# EAGLE design com_board (EAGLE 9.6.2)
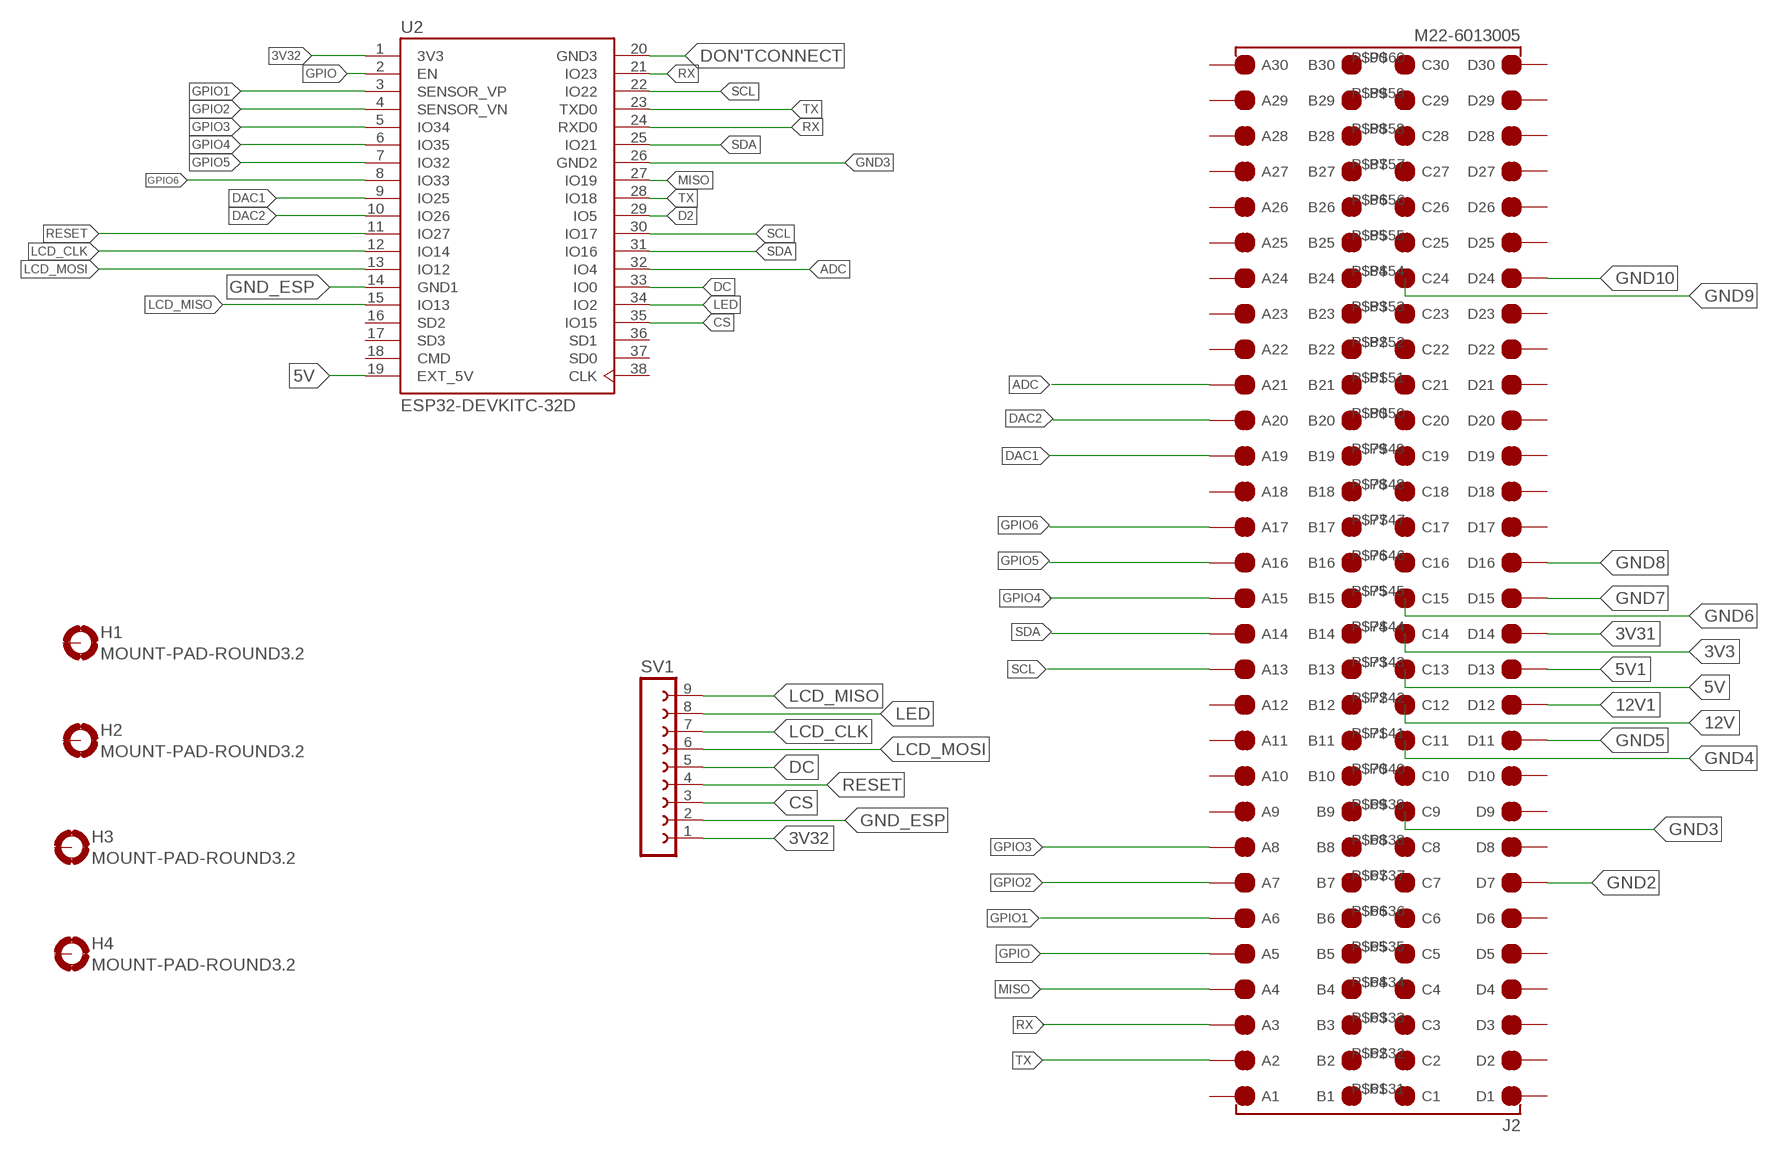
[diagram p0: schematic, sheet 1]

## Parts
H1  MOUNT-PAD-ROUND3.2  [3,2-PAD]
H2  MOUNT-PAD-ROUND3.2  [3,2-PAD]
H3  MOUNT-PAD-ROUND3.2  [3,2-PAD]
H4  MOUNT-PAD-ROUND3.2  [3,2-PAD]
J2  M22-6013005  [RHDR120W55P200_4X30_6020X820X9]
SV1  FE09-1  [FE09]
U2  ESP32-DEVKITC-32D  [MODULE_ESP32-DEVKITC-32D]

## Nets
3V3: J2.P$44(C14)
3V31: J2.P$14(D14)
3V32: SV1.1 U2.1(3V3)
5V: J2.P$43(C13) U2.19(EXT_5V)
5V1: J2.P$13(D13)
12V: J2.P$42(C12)
12V1: J2.P$12(D12)
ADC: J2.P$111(A21) U2.32(IO4)
CS: SV1.3 U2.35(IO15)
D2: U2.29(IO5)
DAC1: J2.P$109(A19) U2.9(IO25)
DAC2: J2.P$110(A20) U2.10(IO26)
DC: SV1.5 U2.33(IO0)
DON'TCONNECT: U2.20(GND3)
GND2: J2.P$7(D7)
GND3: J2.P$39(C9) U2.26(GND2)
GND4: J2.P$41(C11)
GND5: J2.P$11(D11)
GND6: J2.P$45(C15)
GND7: J2.P$15(D15)
GND8: J2.P$16(D16)
GND9: J2.P$54(C24)
GND10: J2.P$24(D24)
GND_ESP: SV1.2 U2.14(GND1)
GPIO: J2.P$95(A5) U2.2(EN)
GPIO1: J2.P$96(A6) U2.3(SENSOR_VP)
GPIO2: J2.P$97(A7) U2.4(SENSOR_VN)
GPIO3: J2.P$98(A8) U2.5(IO34)
GPIO4: J2.P$105(A15) U2.6(IO35)
GPIO5: J2.P$106(A16) U2.7(IO32)
GPIO6: J2.P$107(A17) U2.8(IO33)
LCD_CLK: SV1.7 U2.12(IO14)
LCD_MISO: SV1.9 U2.15(IO13)
LCD_MOSI: SV1.6 U2.13(IO12)
LED: SV1.8 U2.34(IO2)
MISO: J2.P$94(A4) U2.27(IO19)
RESET: SV1.4 U2.11(IO27)
RX: J2.P$93(A3) U2.21(IO23) U2.24(RXD0)
SCL: J2.P$103(A13) U2.22(IO22) U2.30(IO17)
SDA: J2.P$104(A14) U2.25(IO21) U2.31(IO16)
TX: J2.P$92(A2) U2.23(TXD0) U2.28(IO18)
Unconnected: H1.B3,2(MOUNT) H2.B3,2(MOUNT) H3.B3,2(MOUNT) H4.B3,2(MOUNT) J2.P$1(D1) J2.P$2(D2) J2.P$3(D3) J2.P$4(D4) J2.P$5(D5) J2.P$6(D6) J2.P$8(D8) J2.P$9(D9) J2.P$10(D10) J2.P$17(D17) J2.P$18(D18) J2.P$19(D19) J2.P$20(D20) J2.P$21(D21) J2.P$22(D22) J2.P$23(D23) J2.P$25(D25) J2.P$26(D26) J2.P$27(D27) J2.P$28(D28) J2.P$29(D29) J2.P$30(D30) J2.P$31(C1) J2.P$32(C2) J2.P$33(C3) J2.P$34(C4) J2.P$35(C5) J2.P$36(C6) J2.P$37(C7) J2.P$38(C8) J2.P$40(C10) J2.P$46(C16) J2.P$47(C17) J2.P$48(C18) J2.P$49(C19) J2.P$50(C20) J2.P$51(C21) J2.P$52(C22) J2.P$53(C23) J2.P$55(C25) J2.P$56(C26) J2.P$57(C27) J2.P$58(C28) J2.P$59(C29) J2.P$60(C30) J2.P$61(B1) J2.P$62(B2) J2.P$63(B3) J2.P$64(B4) J2.P$65(B5) J2.P$66(B6) J2.P$67(B7) J2.P$68(B8) J2.P$69(B9) J2.P$70(B10) J2.P$71(B11) J2.P$72(B12) J2.P$73(B13) J2.P$74(B14) J2.P$75(B15) J2.P$76(B16) J2.P$77(B17) J2.P$78(B18) J2.P$79(B19) J2.P$80(B20) J2.P$81(B21) J2.P$82(B22) J2.P$83(B23) J2.P$84(B24) J2.P$85(B25) J2.P$86(B26) J2.P$87(B27) J2.P$88(B28) J2.P$89(B29) J2.P$90(B30) J2.P$91(A1) J2.P$99(A9) J2.P$100(A10) J2.P$101(A11) J2.P$102(A12) J2.P$108(A18) J2.P$112(A22) J2.P$113(A23) J2.P$114(A24) J2.P$115(A25) J2.P$116(A26) J2.P$117(A27) J2.P$118(A28) J2.P$119(A29) J2.P$120(A30) U2.16(SD2) U2.17(SD3) U2.18(CMD) U2.36(SD1) U2.37(SD0) U2.38(CLK)

## Library data of the parts
H1-H4 = holes:MOUNT-PAD-ROUND: MOUNTING PAD, round
J2 = M22-6013005:M22-6013005: HARWIN - M22-6013005 - PCB Receptacle, Board-to-Board, 2 mm, 4 Rows, 120 Contacts, Through Hole Mount, M22 Series Source: Datasheet <https://ms.componentsearchengine.com/Datasheets/2/M22-6013005.pdf>; DESCRIPTION: HARWIN - M22-6013005 - PCB Receptacle, Board-to-Board, 2 mm, 4 Rows, 120 Contacts, Through Hole Mount, M22 Series; HEIGHT: 9.65mm; MANUFACTURER_NAME: Harwin; MANUFACTURER_PART_NUMBER: M22-6013005
SV1 = con-lsta:FE09-1: FEMALE HEADER; OC_FARNELL: unknown; OC_NEWARK: unknown
U2 = ESP32-DEVKITC-32D:ESP32-DEVKITC-32D: Eval Board For Esp-Wroom-32 Check prices <https://pricing.snapeda.com/parts/ESP32-DEVKITC-32D/Espressif%20Systems/view-part?ref=eda>; AVAILABILITY: Warning; DESCRIPTION: - Transceiver; 802.11 b/g/n (Wi-Fi, WiFi, WLAN), Bluetooth® Smart Ready 4.x Dual Mode For Use With ESP-WROOM-32; MF: Espressif Systems; MP: ESP32-DEVKITC-32D; PACKAGE: None; PRICE: None; PURCHASE-URL: https://pricing.snapeda.com/search/part/ESP32-DEVKITC-32D/?ref=eda

## Board
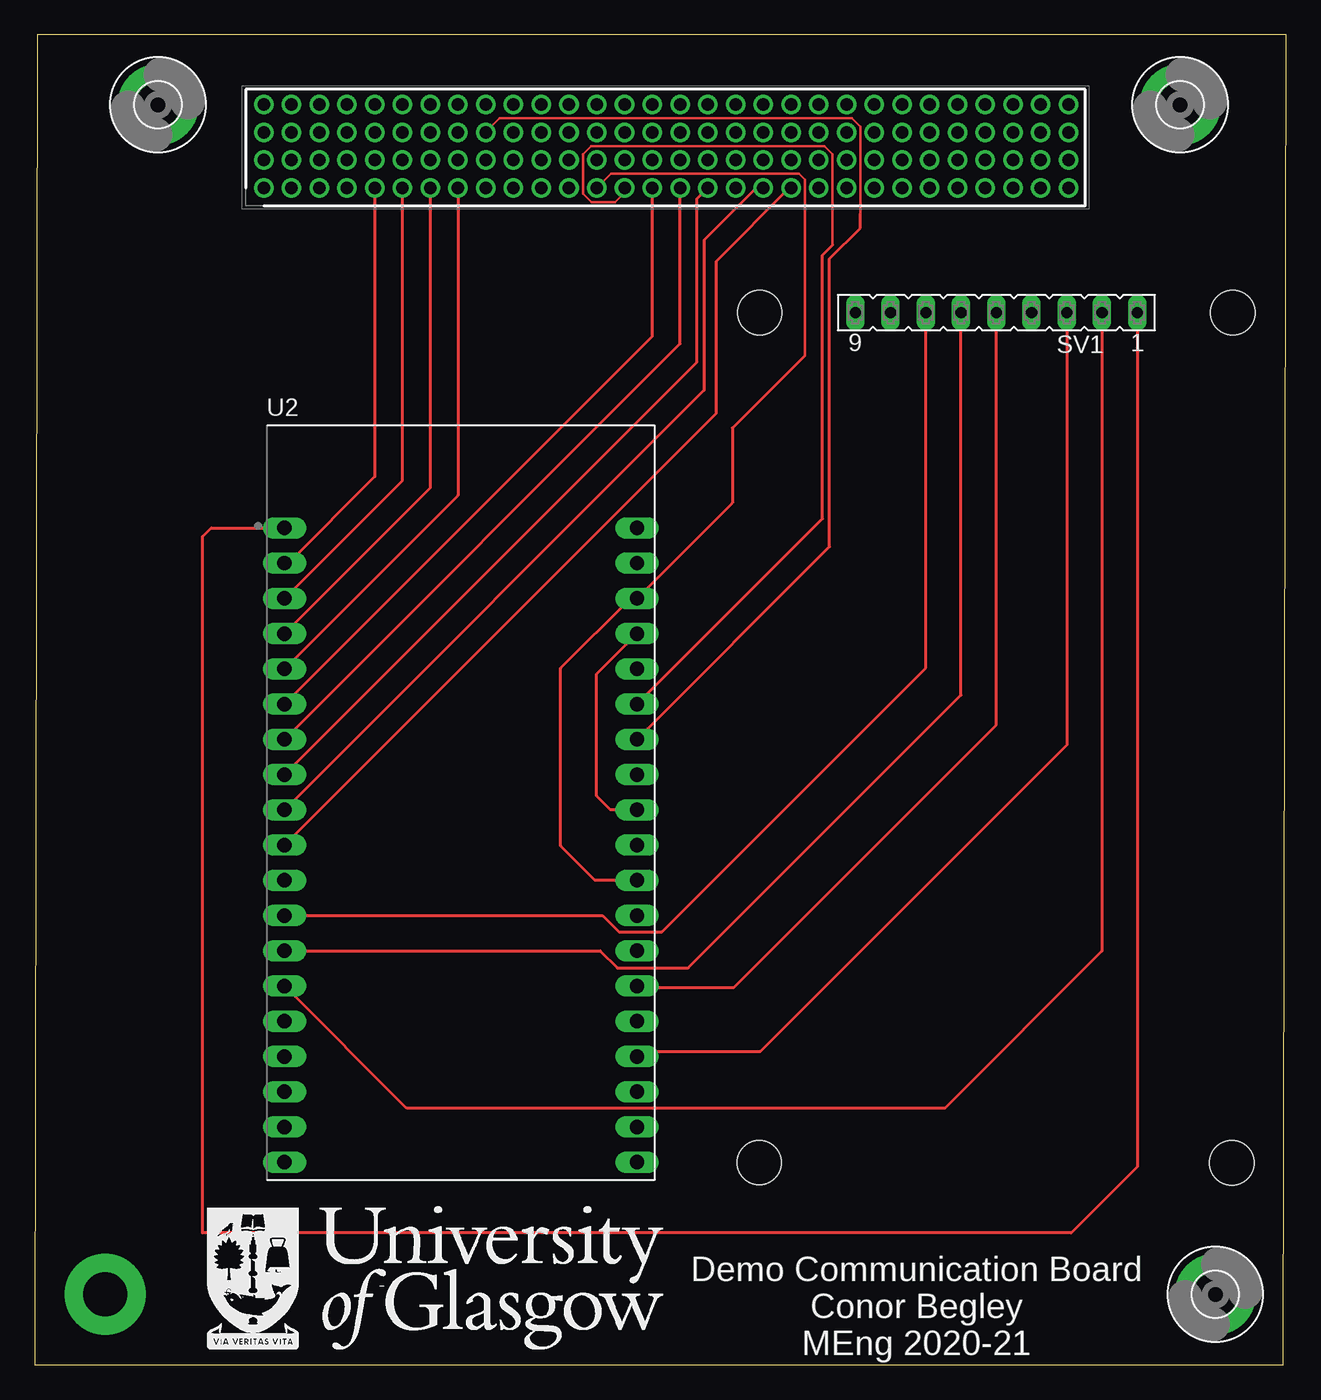
[diagram p1: board, top side]
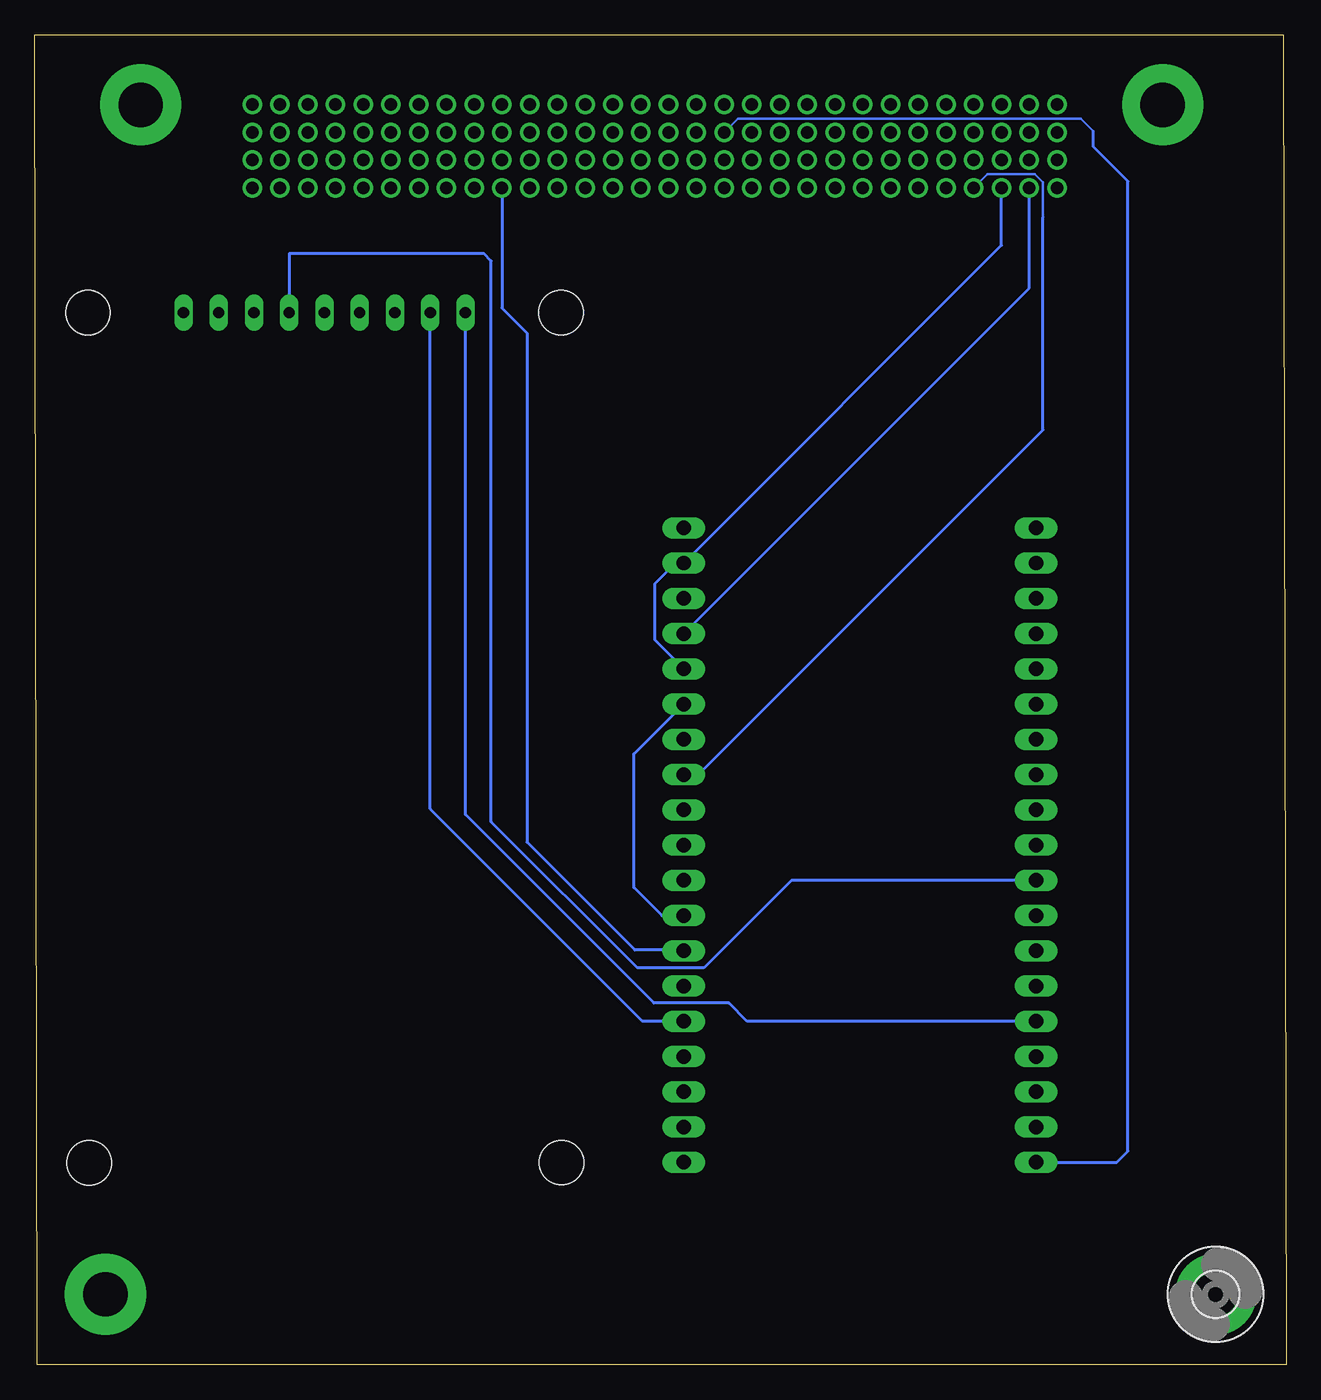
[diagram p2: board, bottom side, seen from below]

Size 90.19 x 95.86 mm. Coordinates in mm from the lower left corner, seen from the top.
Outline: 0,0 90,0 90.19,95.86 0.19,95.86 0,0
Copper layers (1*16): Top 0.035mm / dielectric 1.5mm / Bottom 0.035mm
Design rules "jlcpcb *": minimum track width 6mil, minimum drill 0.35mm, track to track 0.2mm, track to pad 0.2mm, pad to pad 0.54mm, via to via 10mil, smd to smd 6mil, copper to edge 40mil, drill to drill 6mil, minimum pad ring 10mil, minimum via ring 8mil, stop-mask expansion 4mil, vias tented up to drill 0mil, thermal gap 10mil
Holes 3.2 mm at 86.35,75.83 52.25,75.82 86.27,14.55 52.21,14.58

### Footprints (pad centres in the part's own frame; a part is rotated, then mirrored left to right if it is on the bottom)
3,2-PAD = drill 3.2 pad 5.842: B3,2 0,0
RHDR120W55P200_4X30_6020X820X9 = drill 0.9 pad 1.3: P$1 0,6; P$2 2,6; P$3 4,6; P$4 6,6; P$5 8,6; P$6 10,6; P$7 12,6; P$8 14,6; P$9 16,6; P$10 18,6; P$11 20,6; P$12 22,6; P$13 24,6; P$14 26,6; P$15 28,6; P$16 30,6; P$17 32,6; P$18 34,6; P$19 36,6; P$20 38,6; P$21 40,6; P$22 42,6; P$23 44,6; P$24 46,6; P$25 48,6; P$26 50,6; P$27 52,6; P$28 54,6; P$29 56,6; P$30 58,6; P$31 0,4; P$32 2,4; P$33 4,4; P$34 6,4; P$35 8,4; P$36 10,4; P$37 12,4; P$38 14,4; P$39 16,4; P$40 18,4; P$41 20,4; P$42 22,4; P$43 24,4; P$44 26,4; P$45 28,4; P$46 30,4; P$47 32,4; P$48 34,4; P$49 36,4; P$50 38,4; P$51 40,4; P$52 42,4; P$53 44,4; P$54 46,4; P$55 48,4; P$56 50,4; P$57 52,4; P$58 54,4; P$59 56,4; P$60 58,4; P$61 0,2; P$62 2,2; P$63 4,2; P$64 6,2; P$65 8,2; P$66 10,2; P$67 12,2; P$68 14,2; P$69 16,2; P$70 18,2; P$71 20,2; P$72 22,2; P$73 24,2; P$74 26,2; P$75 28,2; P$76 30,2; P$77 32,2; P$78 34,2; P$79 36,2; P$80 38,2; P$81 40,2; P$82 42,2; P$83 44,2; P$84 46,2; P$85 48,2; P$86 50,2; P$87 52,2; P$88 54,2; P$89 56,2; P$90 58,2; P$91 0,0; P$92 2,0; P$93 4,0; P$94 6,0; P$95 8,0; P$96 10,0; P$97 12,0; P$98 14,0; P$99 16,0; P$100 18,0; P$101 20,0; P$102 22,0; P$103 24,0; P$104 26,0; P$105 28,0; P$106 30,0; P$107 32,0; P$108 34,0; P$109 36,0; P$110 38,0; P$111 40,0; P$112 42,0; P$113 44,0; P$114 46,0; P$115 48,0; P$116 50,0; P$117 52,0; P$118 54,0; P$119 56,0; P$120 58,0
FE09 = drill 0.813 long: 1 -10.16,0; 2 -7.62,0; 3 -5.08,0; 4 -2.54,0; 5 0,0; 6 2.54,0; 7 5.08,0; 8 7.62,0; 9 10.16,0
MODULE_ESP32-DEVKITC-32D = drill 1.04 long: 1 -12.7,19.76; 2 -12.7,17.22; 3 -12.7,14.68; 4 -12.7,12.14; 5 -12.7,9.6; 6 -12.7,7.06; 7 -12.7,4.52; 8 -12.7,1.98; 9 -12.7,-0.56; 10 -12.7,-3.1; 11 -12.7,-5.64; 12 -12.7,-8.18; 13 -12.7,-10.72; 14 -12.7,-13.26; 15 -12.7,-15.8; 16 -12.7,-18.34; 17 -12.7,-20.88; 18 -12.7,-23.42; 19 -12.7,-25.96; 20 12.7,19.76; 21 12.7,17.22; 22 12.7,14.68; 23 12.7,12.14; 24 12.7,9.6; 25 12.7,7.06; 26 12.7,4.52; 27 12.7,1.98; 28 12.7,-0.56; 29 12.7,-3.1; 30 12.7,-5.64; 31 12.7,-8.18; 32 12.7,-10.72; 33 12.7,-13.26; 34 12.7,-15.8; 35 12.7,-18.34; 36 12.7,-20.88; 37 12.7,-23.42; 38 12.7,-25.96

### Placement (x,y rotation side)
H1  5.08,5.08 0 bottom
H2  85.09,5.08 0 top
H3  8.89,90.81 0 top
H4  82.55,90.81 0 top
J2  16.51,84.82 0 top
SV1  69.31,75.83 180 top
U2  30.71,40.56 0 top

### Tracks (layer width: path | path; a pad name or v marks a point on that pad's centre or on a via)
3V32
  Top 0.2: SV1.1 79.47,14.27 74.7,9.5 12.1,9.5 12.1,59.7 12.72,60.32 U2.1
5V
  Bottom 0.17: J2.P$43 39.52,89.81 14.81,89.81 13.9,88.9
  Bottom 0.2: U2.19 12.2,14.6 11.4,15.4 11.4,85.3 13.9,87.8 13.9,88.9
ADC
  Bottom 0.2: U2.32 43.46,29.89 46.94,29.89 54.72,37.67 54.72,74.36 56.51,76.16 J2.P$111
CS
  Top 0.2: U2.35 43.79,22.6 52.3,22.6 74.37,44.67 74.37,74.86 74.39,74.88 SV1.3
DAC1
  Top 0.2: U2.9 48.25,70.24 48.25,81.06 52.01,84.82 J2.P$109
DAC2
  Top 0.2: U2.10 49.11,68.56 49.11,79.52 54.41,84.82 J2.P$110
DC
  Top 0.2: U2.33 43.51,27.2 50.4,27.2 69.31,46.1 SV1.5
GND3
  Top 0.17: 59.5,82.93 59.5,89.23 58.9,89.83 33.52,89.83 J2.P$39
  Top 0.2: U2.26 57.3,58.97 57.3,79.73 59.5,81.93 59.5,82.93
GND_ESP
  Top 0.2: SV1.2 76.92,29.82 65.6,18.5 26.81,18.5 U2.14
GPIO
  Top 0.2: U2.2 18.29,57.78 24.52,64 J2.P$95
GPIO1
  Top 0.2: U2.3 26.51,63.74 J2.P$96
GPIO2
  Top 0.2: U2.4 28.51,63.2 J2.P$97
GPIO3
  Top 0.2: U2.5 30.51,62.66 J2.P$98
GPIO4
  Top 0.2: U2.6 44.51,74.12 J2.P$105
GPIO5
  Top 0.2: U2.7 46.51,73.58 J2.P$106
GPIO6
  Top 0.2: U2.8 47.71,72.24 47.71,84.02 J2.P$107
LCD_CLK
  Top 0.2: U2.12 40.92,32.38 42.1,31.2 45.2,31.2 64.22,50.23 SV1.7
LCD_MISO
  Bottom 0.2: U2.15 38.84,24.76 40.16,26.08 45.56,26.08 59.15,39.66 SV1.9
LCD_MOSI
  Top 0.2: U2.13 40.76,29.84 42,28.6 47.1,28.6 66.77,48.27 SV1.6
LED
  Bottom 0.2: U2.34 46.38,24.76 61.69,40.06 SV1.8
MISO
  Bottom 0.17: J2.P$94 21.52,85.81 18.1,85.81 17.52,85.23 17.52,82.72 17.53,82.72
  Bottom 0.2: U2.27 42.36,42.54 17.53,67.37 17.53,82.72
RESET
  Bottom 0.2: U2.11 35.65,34.92 41.96,28.61 46.76,28.61 57.28,39.13 57.28,79.55 57.81,80.08 71.84,80.08 SV1.4
RX
  Bottom 0.2: J2.P$93 20.51,80.68 U2.21 44.02,57.78 45.5,56.3 45.5,52.25 U2.24
SCL
  Top 0.17: 55.5,72.72 55.5,85.41 55.08,85.83 41.52,85.83 J2.P$103
  Top 0.2: 55.5,72.72 50.29,67.51 50.29,62.12 U2.22 42.94,55.24 37.9,50.2 37.9,37.4 40.38,34.92 U2.30
SDA
  Top 0.17: 57.5,80.71 57.5,87.23 56.92,87.81 40.09,87.81 39.52,87.24 39.52,84.41 40.13,83.8 41.83,83.8 42.5,84.47 J2.P$104
  Top 0.2: U2.25 56.77,60.98 56.77,79.98 57.5,80.71
  Bottom 0.2: U2.31 44.98,32.38 47,34.4 47,44.03 U2.25
TX
  Top 0.2: U2.28 41.5,40 40.5,41 40.5,49.79 U2.23
  Bottom 0.2: U2.23 18.51,77.6 J2.P$92

### Text on the board
tPlace: Demo Communication Board / Conor Begley / MEng 2020-21